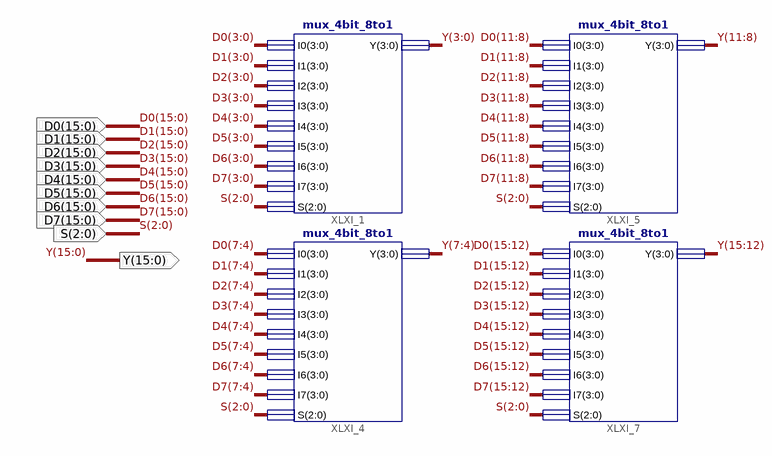
[diagram p0: schematic sheet 1]
// Xilinx ISE schematic mux_16bit_8to1.sch (virtex6) as structural Verilog: 4 symbols, 10 ports
module mux_16bit_8to1 (
  input  [15:0] D0,
  input  [15:0] D1,
  input  [15:0] D2,
  input  [15:0] D3,
  input  [15:0] D4,
  input  [15:0] D5,
  input  [15:0] D6,
  input  [15:0] D7,
  input  [2:0] S,
  output [15:0] Y
);

  mux_4bit_8to1 XLXI_5 (
    .I0(D0[11:8]), .I1(D1[11:8]), .I2(D2[11:8]), .I3(D3[11:8]), .I4(D4[11:8]), .I5(D5[11:8]), .I6(D6[11:8]),
    .I7(D7[11:8]), .S(S), .Y(Y[11:8]));
  mux_4bit_8to1 XLXI_7 (
    .I0(D0[15:12]), .I1(D1[15:12]), .I2(D2[15:12]), .I3(D3[15:12]), .I4(D4[15:12]), .I5(D5[15:12]),
    .I6(D6[15:12]), .I7(D7[15:12]), .S(S), .Y(Y[15:12]));
  mux_4bit_8to1 XLXI_4 (
    .I0(D0[7:4]), .I1(D1[7:4]), .I2(D2[7:4]), .I3(D3[7:4]), .I4(D4[7:4]), .I5(D5[7:4]), .I6(D6[7:4]),
    .I7(D7[7:4]), .S(S), .Y(Y[7:4]));
  mux_4bit_8to1 XLXI_1 (
    .I0(D0[3:0]), .I1(D1[3:0]), .I2(D2[3:0]), .I3(D3[3:0]), .I4(D4[3:0]), .I5(D5[3:0]), .I6(D6[3:0]),
    .I7(D7[3:0]), .S(S), .Y(Y[3:0]));
endmodule
